# Altium schematic sheet Steering Wheel Interface Connectors.SchDoc: Title
size B; Organization: Midnight Sun Solar Rayce Car Team; Address1: University of Waterloo; Address2: 200 University Ave W; Address3: Waterloo, ON, Canada; Address4: N2L 3E9; Website: www.uwmidsun.com; ProjectName: ProjectName
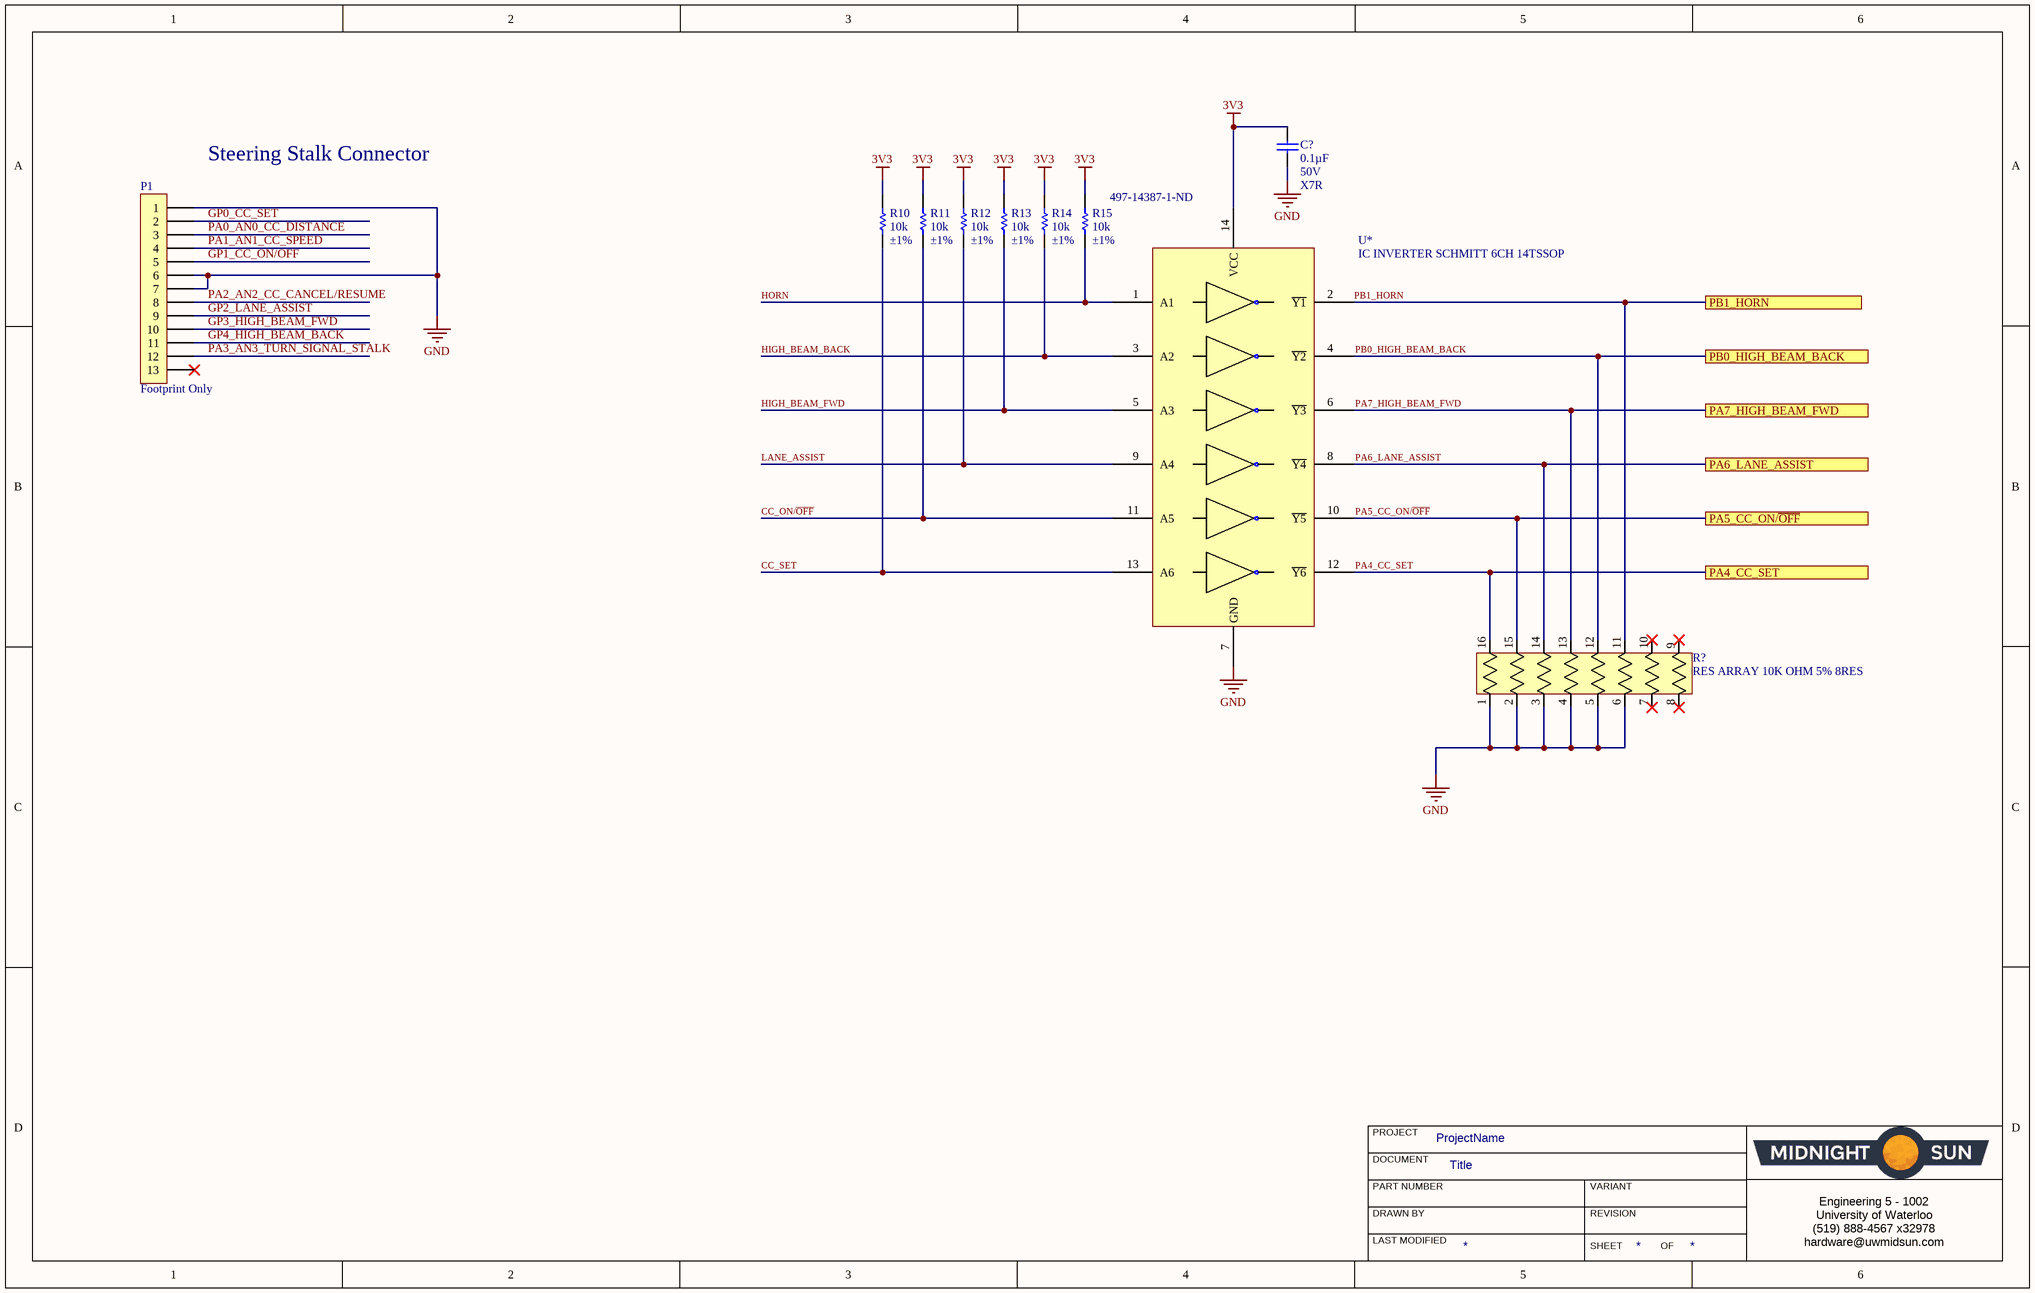
[diagram p0: Steering Wheel Interface Connectors.SchDoc]

## Parts
C?  Capacitance: 0.1µF  Voltage: 50V  Temperature Coefficient: X7R  [CAP, 0603]  (hidden comment: CAP CER 0.1UF 50V 10% X7R 0603)
P1  Footprint Only  [CONN 13POS CARD EDGE]  (no BOM)
R10  Tolerance: ±1%  Resistance: 10k  [RES, 0603]  (hidden comment: RES 10K OHM 1% 1/10W 0603)
R11  Tolerance: ±1%  Resistance: 10k  [RES, 0603]  (hidden comment: RES 10K OHM 1% 1/10W 0603)
R12  Tolerance: ±1%  Resistance: 10k  [RES, 0603]  (hidden comment: RES 10K OHM 1% 1/10W 0603)
R13  Tolerance: ±1%  Resistance: 10k  [RES, 0603]  (hidden comment: RES 10K OHM 1% 1/10W 0603)
R14  Tolerance: ±1%  Resistance: 10k  [RES, 0603]  (hidden comment: RES 10K OHM 1% 1/10W 0603)
R15  Tolerance: ±1%  Resistance: 10k  [RES, 0603]  (hidden comment: RES 10K OHM 1% 1/10W 0603)
R?  RES ARRAY 10K OHM 5% 8RES  [RES ARRAY, 8 POS 1506]
U*  IC INVERTER SCHMITT 6CH 14TSSOP  Supplier Part Number 1: 497-14387-1-ND  [IC INVERTER SCHMITT 6CH 14TSSOP]

## Ports
PA4_CC_SET, PA5_CC_ON/~{OFF}, PA6_LANE_ASSIST, PA7_HIGH_BEAM_FWD, PB0_HIGH_BEAM_BACK, PB1_HORN

## Nets
3V3: C?.1 R10.1 R11.1 R12.1 R13.1 R14.1 R15.1 U*.14(VCC)
GND: C?.2 P1.1 P1.6 P1.7 R?.1 R?.2 R?.3 R?.4 R?.5 R?.6 U*.7(GND)
CC_ON/~{OFF}: R11.2 U*.11(A5)
CC_SET: R10.2 U*.13(A6)
GP0_CC_SET: P1.2
GP1_CC_ON/~{OFF}: P1.5
GP2_LANE_ASSIST: P1.9
GP3_HIGH_BEAM_FWD: P1.10
GP4_HIGH_BEAM_BACK: P1.11
HIGH_BEAM_BACK: R14.2 U*.3(A2)
HIGH_BEAM_FWD: R13.2 U*.5(A3)
HORN: R15.2 U*.1(A1)
LANE_ASSIST: R12.2 U*.9(A4)
PA0_AN0_CC_DISTANCE: P1.3
PA1_AN1_CC_SPEED: P1.4
PA2_AN2_CC_CANCEL/RESUME: P1.8
PA3_AN3_TURN_SIGNAL_STALK: P1.12
PA4_CC_SET: R?.16 U*.12(~{Y6}) ; port PA4_CC_SET
PA5_CC_ON/~{OFF}: R?.15 U*.10(~{Y5}) ; port PA5_CC_ON/~{OFF}
PA6_LANE_ASSIST: R?.14 U*.8(~{Y4}) ; port PA6_LANE_ASSIST
PA7_HIGH_BEAM_FWD: R?.13 U*.6(~{Y3}) ; port PA7_HIGH_BEAM_FWD
PB0_HIGH_BEAM_BACK: R?.12 U*.4(~{Y2}) ; port PB0_HIGH_BEAM_BACK
PB1_HORN: R?.11 U*.2(~{Y1}) ; port PB1_HORN

Not connected (* = marked no-connect by the designer): P1 13*; R? 7* 8* 9* 10*

## Notes on the sheet
- Steering Stalk Connector
- Labels drawn without touching a wire or pin: PB1_HORN
- PROJECT
- DOCUMENT
- DRAWN BY
- LAST MODIFIED
- PART NUMBER
- REVISION
- SHEET
- VARIANT
- OF
- Engineering 5 - 1002
  University of Waterloo
  (519) 888-4567 x32978
  hardware@uwmidsun.com

## Library data of the parts
C? = CAP CER 0.1UF 50V 10% X7R 0603: 0.10µF ±10% 50V Ceramic Capacitor X7R 0603 (1608 Metric); Manufacturer 1: AVX Corporation; Manufacturer Part Number 1: 06035C104KAT2A; Supplier 1: Digi-Key; Supplier Part Number 1: 478-5052-1-ND; Packaging: Cut Tape (CT); Part Status: Active; Operating Temperature: -55°C ~ 125°C; Ratings: -; Mounting Type: Surface Mount, MLCC; Package / Case: 0603 (1608 Metric); Size / Dimension: 0.063" L x 0.032" W (1.60mm x 0.81mm); Height - Seated (Max): -; Thickness (Max): 0.035" (0.90mm); Lead Spacing: -; Lead Style: -; ComponentLink1URL: http://datasheets.avx.com/X7RDielectric.pdf; ComponentLink1Description: http://datasheets.avx.com/X7RDielectric.pdf; Tolerance: ±10%
P1 = CONN 13POS 0.1" CARD EDGE
R10-R15 = RES 10K OHM 1% 1/10W 0603: RES SMD 10K OHM 1% 1/10W 0603; Manufacturer 1: Yageo; Manufacturer Part Number 1: RC0603FR-0710KL; Temperature Coefficient: ±100ppm/°C; Supplier 1: Digi-Key; Supplier Part Number 1: 311-10.0KHRCT-ND; Packaging: Cut Tape (CT); Part Status: Active; Composition: Thick Film; Operating Temperature: -55°C ~ 155°C; Package / Case: 0603 (1608 Metric); Supplier Device Package: 0603; Size / Dimension: 0.063" L x 0.031" W (1.60mm x 0.80mm); Height - Seated (Max): 0.022" (0.55mm); Failure Rate: -; ComponentLink1URL: http://www.yageo.com/documents/recent/PYu-RC_Group_51_RoHS_L_7.pdf; ComponentLink1Description: http://www.yageo.com/documents/recent/PYu-RC_Group_51_RoHS_L_7.pdf; Power: 1/10W
R? = RES ARRAY 10K OHM 5% 8RES EXB-2HV103JV: RES ARRAY SMD 10K 5% 62.5mW 1506; Manufacturer: Panasonic Electronic Components; Vendor: Panasonic; C: Copyright (C) 2015 Accelerated Designs. All rights reserved; Circuit Type: Isolated; Temperature Coefficient: ±200ppm/°C; Value: Value; Copyright: Copyright (C) 2015 Accelerated Designs. All rights reserved; Manufacturer_Part_Number: EXB-2HV103JV; Supplier 1: Digi-Key; Manufacturer Part Number: EXB-2HV103JV; RoHS: RoHS Compliant; Category: Resistors; Stock 1: 152779; Pricing 1: 1=0.43, 10=0.373, 25=0.2712, 50=0.1964, 100=0.1456, 250=0.11176, 500=0.08806, 1000=0.06096 (CAD); Packaging: Cut Tape (CT); Part Status: Active; Resistance (Ohms): 10k; Tolerance: ±5%; Power Per Element: 62.5mW; Operating Temperature: -55°C ~ 125°C; Applications: Automotive AEC-Q200; Mounting Type: Surface Mount; Package / Case: 1506, Convex, Long Side Terminals; Supplier Device Package: 1506; Size / Dimension: 0.150" L x 0.063" W (3.80mm x 1.60mm); Height - Seated (Max): 0.022" (0.55mm); ComponentLink1URL: https://industrial.panasonic.com/cdbs/www-data/pdf/AOC0000/AOC0000C14.pdf; ComponentLink1Description: https://industrial.panasonic.com/cdbs/www-data/pdf/AOC0000/AOC0000C14.pdf; Supplier Part Number 1: Y1103CT-ND
U* = IC INVERTER SCHMITT 6CH 14TSSOP: Inverter IC 6 Channel Schmitt Trigger 14-TSSOP; Manufacturer: STMicroelectronics; Manufacturer Part Number: M74HC14YTTR; Number of Inputs: 6; Propagation Delay: 21ns; Max Supply Voltage: 6V; Min Supply Voltage: 2V; Quiescent Current: 1uA; High Level Output Current: 5.2mA; Turn-On Delay Time: 25ns; ComponentLink1Description: Digikey; ComponentLink1URL: https://www.digikey.ca/product-detail/en/stmicroelectronics/M74HC14YTTR/497-14387-1-ND/4725844; Supplier 1: Digi-Key; RoHS: Yes; Stock 1: 20035; Pricing 1: 1 = 0.44000, 10 = 0.37500, 100 = 0.27970, 500 = 0.21980, 1000 = 0.16985 (USD); Mount: Surface Mount; Case/Package: TSSOP; Number of Pins: 14; Weight: 0.004949oz; Min Operating Temperature: -40°C; Max Operating Temperature: 125°C; Packaging: Tape and Reel; Package Quantity: 2500; Logic Function: Inverter; Number of Circuits: 6; Low Level Output Current: 5.2mA; Lead Free: Lead Free; ComponentLink2URL: http://www.st.com/content/ccc/resource/technical/document/datasheet/19/a3/52/42/dd/ab/4b/46/CD00000263.pdf/files/CD00000263.pdf/jcr:content/translations/en.CD00000263.pdf; ComponentLink2Description: http://www.st.com/content/ccc/resource/technical/document/datasheet/19/a3/52/42/dd/ab/4b/46/CD00000263.pdf/files/CD00000263.pdf/jcr:content/translations/en.CD00000263.pdf; ComponentLink3URL: http://www.st.com/st-web-ui/static/active/en/resource/technical/document/datasheet/CD00000263.pdf; ComponentLink3Description: http://www.st.com/st-web-ui/static/active/en/resource/technical/document/datasheet/CD00000263.pdf